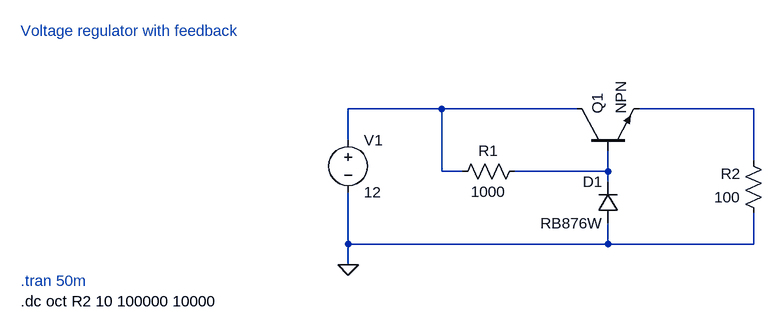
[diagram p0: schematic VoltageStabilizerNpnBJT.asc]
VoltageStabilizerNpnBJT.asc, the LTspice schematic file:
Version 4.1
SHEET 1 880 680
WIRE 144 16 0 16
WIRE 352 16 144 16
WIRE 624 16 448 16
WIRE 0 64 0 16
WIRE 624 96 624 16
WIRE 144 112 144 16
WIRE 176 112 144 112
WIRE 400 112 400 80
WIRE 400 112 256 112
WIRE 400 128 400 112
WIRE 0 224 0 144
WIRE 400 224 400 192
WIRE 400 224 0 224
WIRE 624 224 624 176
WIRE 624 224 400 224
WIRE 0 256 0 224
FLAG 0 256 0
SYMBOL voltage 0 48 R0
WINDOW 123 0 0 Left 0
WINDOW 39 0 0 Left 0
SYMATTR InstName V1
SYMATTR Value 12
SYMBOL diode 416 192 R180
WINDOW 0 24 64 Left 2
WINDOW 3 24 0 Left 2
SYMATTR InstName D1
SYMATTR Value RB876W
SYMATTR Description Diode
SYMATTR Type diode
SYMBOL res 272 96 R90
WINDOW 0 0 56 VBottom 2
WINDOW 3 32 56 VTop 2
SYMATTR InstName R1
SYMATTR Value 1000
SYMBOL res 640 192 R180
WINDOW 0 36 76 Left 2
WINDOW 3 36 40 Left 2
SYMATTR InstName R2
SYMATTR Value 100
SYMBOL npn 352 80 R270
SYMATTR InstName Q1
TEXT -504 -104 Left 2 ;Voltage regulator with feedback
TEXT -504 280 Left 2 ;.tran 50m
TEXT -504 312 Left 2 !.dc oct R2 10 100000 10000

The netlist it stands for:
* VoltageStabilizerNpnBJT.asc
V1 N001 0 12
D1 0 N003 RB876W
R1 N003 N001 1000
R2 0 N002 100
Q1 N001 N003 N002 0 NPN
.model D D
.lib standard.dio
.model NPN NPN
.model PNP PNP
.lib standard.bjt
* Voltage regulator with feedback
* .tran 50m
.dc oct R2 10 100000 10000
.backanno
.end